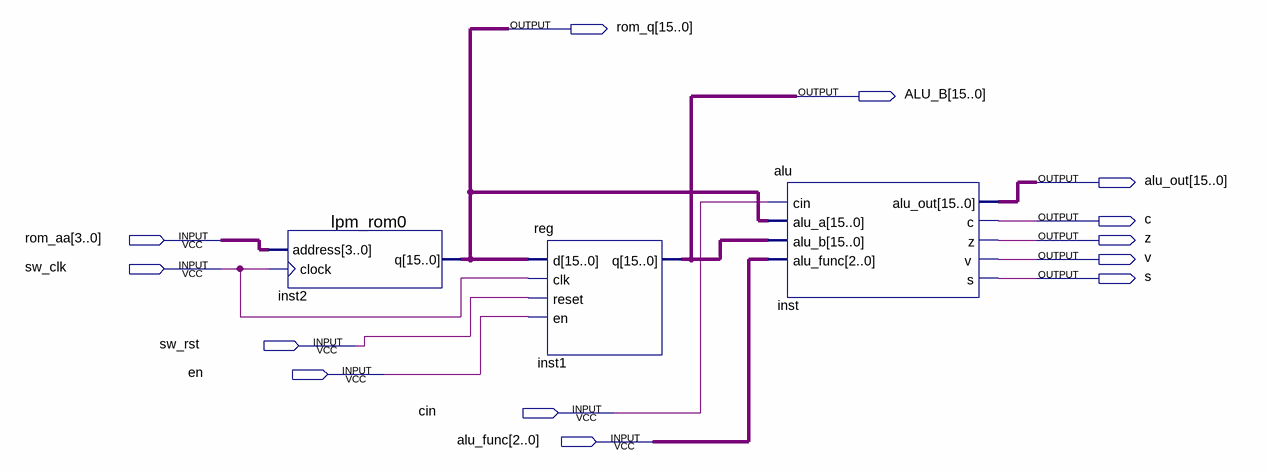
[diagram p0: schematic sheet]
// Quartus schematic alu_1.bdf as structural Verilog: 3 symbols, 13 pins
module alu_1 (
  input  [3:0] rom_aa,
  input  sw_clk,
  input  sw_rst,
  input  en,
  input  cin,
  input  [2:0] alu_func,
  output [15:0] rom_q,
  output [15:0] ALU_B,
  output [15:0] alu_out,
  output c,
  output z,
  output v,
  output s
);

  lpm_rom0 inst2 (.address(rom_aa), .clock(sw_clk), .q(rom_q));
  \reg  inst1 (.d(rom_q), .clk(sw_clk), .reset(sw_rst), .en(en), .q(ALU_B));
  alu inst (
    .cin(cin), .alu_a(rom_q), .alu_b(ALU_B), .alu_func(alu_func), .alu_out(alu_out), .c(c), .z(z), .v(v),
    .s(s));
endmodule
